# EAGLE schematic schemat Czujników (EAGLE 9.6.2)
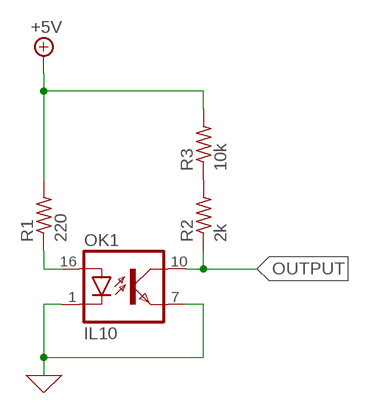
[diagram p0: schematic, sheet 1]

## Parts
OK1  IL10  [DIL16-4_1_7_10_16]
R1  220  R-US_0207/10  [0207/10]
R2  2k  R-US_0207/10  [0207/10]
R3  10k  R-US_0207/10  [0207/10]

## Nets
0: OK1.1(C) OK1.7(EMIT) ; supply symbol labelled GND
+5V: R1.2 R3.2
N$1: R2.2 R3.1
N$2: OK1.16(A) R1.1
OUTPUT: OK1.10(COL) R2.1

## Library data of the parts
OK1 = optocoupler:IL10: SIEMENS OPTO COUPLER; OC_FARNELL: unknown; OC_NEWARK: unknown
R1-R3 = rcl:R-US_: RESISTOR, American symbol; SPICEPREFIX: R